# Altium schematic sheet SC942C_Coeur.SchDoc: Coeur
size 393 x 270 mm; CompanyName: Seccom; Address1: 521, rue du capt. François Garbit; Address2: 69440 Mornant; Address3: seccom@seccom.fr; Address4: www.seccom.fr; DocumentNumber: 2; SheetNumber: 2; SheetTotal: 8; PageSetup: Record=PageOptions|CenterHorizontal=True|CenterVertical=True|PrintScale=0.74|XCorrection=1.00|YCorrection=1.00|PrintKind=0|BorderSize=5000000|LeftOffset=0|BottomOffset=0|Orientation=2|PaperLength=1000|PaperWidth=1000|Scale=100|PaperSource=7|PrintQuality=-4|MediaType=1|DitherType=10|PaperKind=A4|PrintScaleMode=1
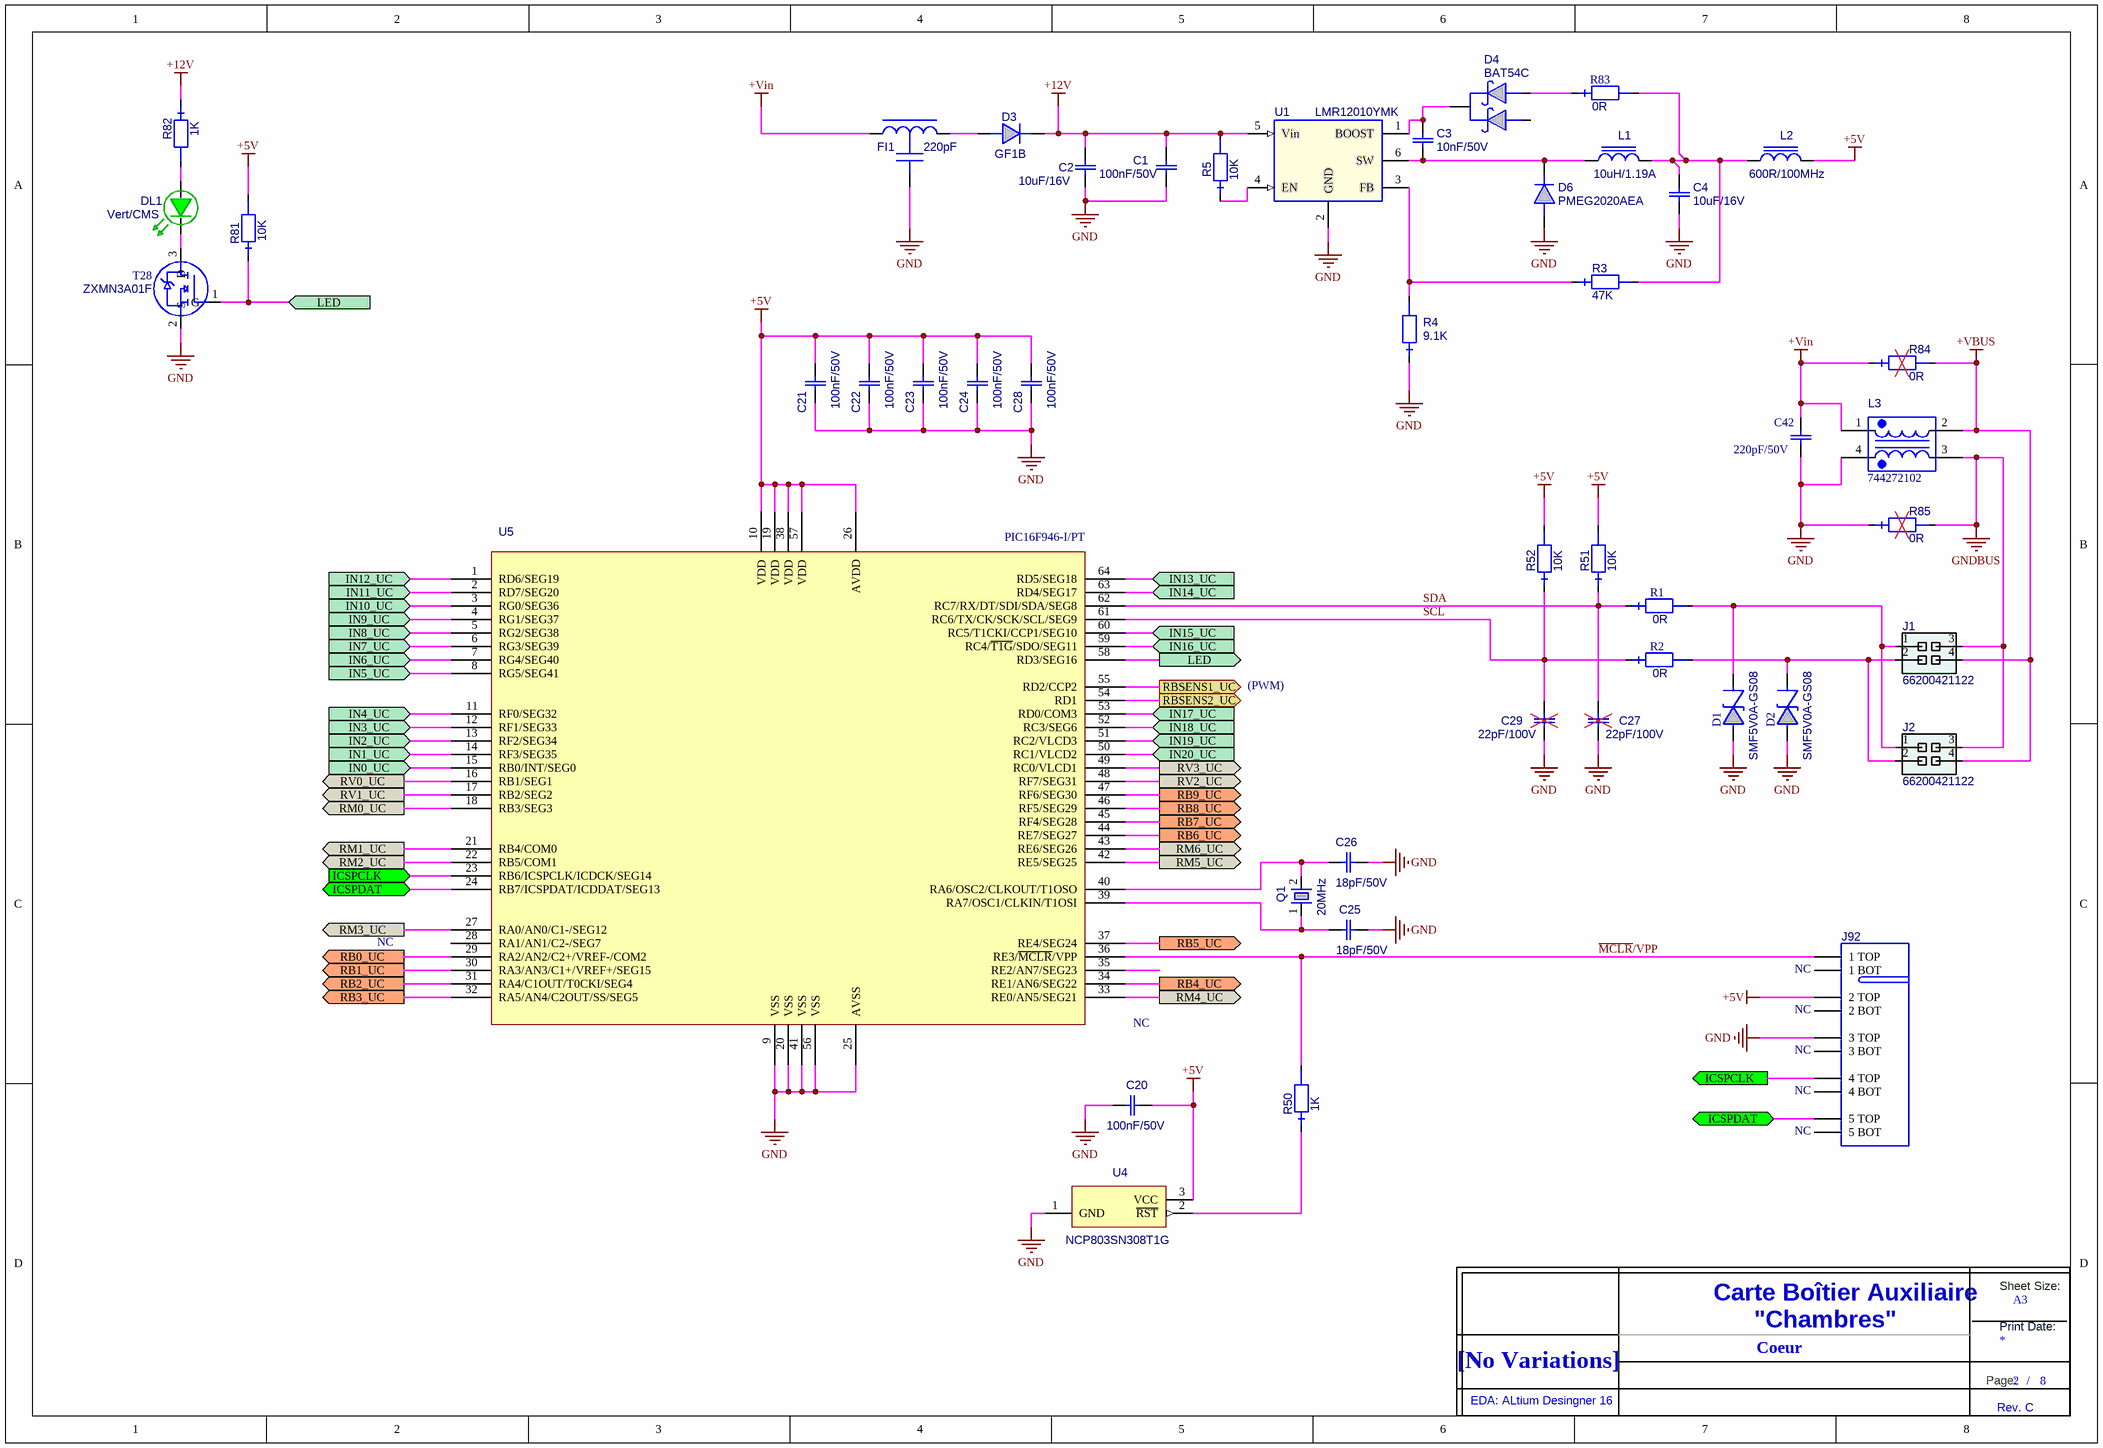
[diagram p0: SC942C_Coeur.SchDoc]

## Parts
C1  value 100nF/50V  [0805_ReflowSoldering_CAP]  (hidden comment: C_0805_X7R_10%_100N-50V)
C2  value 10uF/16V  [0805_ReflowSoldering_CAP]  (hidden comment: C_0805_X5R_10%_10U-16V)
C3  value 10nF/50V  [0603_ReflowSoldering_CAP]  (hidden comment: C_0603_X7R_10%_10N-50V)
C4  value 10uF/16V  [0805_ReflowSoldering_CAP]  (hidden comment: C_0805_X5R_10%_10U-16V)
C20  value 100nF/50V  [0805_ReflowSoldering_CAP]  (hidden comment: C_0805_X7R_10%_100N-50V)
C21  value 100nF/50V  [0805_ReflowSoldering_CAP]  (hidden comment: C_0805_X7R_10%_100N-50V)
C22  value 100nF/50V  [0805_ReflowSoldering_CAP]  (hidden comment: C_0805_X7R_10%_100N-50V)
C23  value 100nF/50V  [0805_ReflowSoldering_CAP]  (hidden comment: C_0805_X7R_10%_100N-50V)
C24  value 100nF/50V  [0805_ReflowSoldering_CAP]  (hidden comment: C_0805_X7R_10%_100N-50V)
C25  value 18pF/50V  [0603_ReflowSoldering_CAP]  (hidden comment: C_0603_NPO_5%_18P-50V)
C26  value 18pF/50V  [0603_ReflowSoldering_CAP]  (hidden comment: C_0603_NPO_5%_18P-50V)
C27  value 22pF/100V  [0805_ReflowSoldering_CAP]  (hidden comment: C_0805_NPO_5%_22P-100V)  (no BOM)
C28  value 100nF/50V  [0805_ReflowSoldering_CAP]  (hidden comment: C_0805_X7R_10%_100N-50V)
C29  value 22pF/100V  [0805_ReflowSoldering_CAP]  (hidden comment: C_0805_NPO_5%_22P-100V)  (no BOM)
C42  Capacitance: 220pF/50V  [0603_ReflowSoldering_CAP]  (hidden comment: C_0603_NPO_5%_220pF-50V)
D1  SMF5V0A-GS08  [DO219AB-SMF-P_ReflowSoldering]
D2  SMF5V0A-GS08  [DO219AB-SMF-P_ReflowSoldering]
D3  GF1B  [DO214BA-P]
D4  BAT54C  [SOT23_3L_ReflowSoldering]
D6  PMEG2020AEA  [SOD323_ReflowSoldering]
DL1  value Vert/CMS  [LED_0805_KPx_Green]  (hidden comment: LED_0805_VERT_KP2012)
FI1  value 220pF  [NFE31P]  (hidden comment: EMIFIL_220P_25V/6A_NFE31PT221D1E9L)
J1  value 66200421122  [MICRO-MATE-N-LOK_WURTH+TYCO_2X02_D]  (hidden comment: MICRO-MATE-N-LOK_WURTH_2X02_D)
J2  value 66200421122  [MICRO-MATE-N-LOK_WURTH+TYCO_2X02_D]  (hidden comment: MICRO-MATE-N-LOK_WURTH_2X02_D)
J92  EMB_ZEC_1893711_HOTE  [EMB_ZEC_1893711_HOTE_NOBOTT]  (value not drawn)  (no BOM)
L1  value 10uH/1.19A  [SELF_WE-TPC_4.8x4.78_(type4828)]  (hidden comment: SELF_10UH_1.19A_744043100)
L2  value 600R/100MHz  [1206_ReflowSoldering_FERRITE]  (hidden comment: IND_FERRITE_1206_74279218)
L3  744272102  [744272102]
Q1  value 20MHz  [QUARTZ_HC49_11.5X5_CMS]  (hidden comment: QUARTZ_HC49/4HSMX_20M)
R1  value 0R  [0805_ReflowSoldering_RES]  (hidden comment: RES_0805_1%_100PPM_0R)
R2  value 0R  [0805_ReflowSoldering_RES]  (hidden comment: RES_0805_1%_100PPM_0R)
R3  value 47K  [0805_ReflowSoldering_RES]  (hidden comment: RES_0805_1%_100PPM_47K)
R4  value 9.1K  [0805_ReflowSoldering_RES]  (hidden comment: RES_0805_1%_100PPM_9.1K)
R5  value 10K  [0805_ReflowSoldering_RES]  (hidden comment: RES_0805_1%_100PPM_10K)
R50  value 1K  [0805_ReflowSoldering_RES]  (hidden comment: RES_0805_1%_100PPM_1K)
R51  value 10K  [0805_ReflowSoldering_RES]  (hidden comment: RES_0805_1%_100PPM_10K)
R52  value 10K  [0805_ReflowSoldering_RES]  (hidden comment: RES_0805_1%_100PPM_10K)
R81  value 10K  [0805_ReflowSoldering_RES]  (hidden comment: RES_0805_1%_100PPM_10K)
R82  value 1K  [0805_ReflowSoldering_RES]  (hidden comment: RES_0805_1%_100PPM_1K)
R83  value 0R  [0805_ReflowSoldering_RES]  (hidden comment: RES_0805_1%_100PPM_0R)
R84  value 0R  [0603_ReflowSoldering_RES]  (hidden comment: RES_0603_1%_100PPM_0R)  (no BOM)
R85  value 0R  [0603_ReflowSoldering_RES]  (hidden comment: RES_0603_1%_100PPM_0R)  (no BOM)
T28  ZXMN3A01F  [SOT23_3L_ReflowSoldering]
Title_new?  DNI  (value not drawn)  (graphical)
U1  LMR12010YMK  [SOT23_6L]
U4  NCP803SN308T1G  [SOT23_3L_ReflowSoldering]
U5  PIC16F946-I/PT  [QFP_064_E0,50_10X10MM]

## Ports
ICSPCLK (in), ICSPCLK (out), ICSPDAT, ICSPDAT (bidir), IN0_UC (in), IN1_UC (in), IN2_UC (in), IN3_UC (in), IN4_UC (in), IN5_UC (in), IN6_UC (in), IN7_UC (in), IN8_UC (in), IN9_UC (in), IN10_UC (in), IN11_UC (in), IN12_UC (in), IN13_UC (in), IN14_UC (in), IN15_UC (in), IN16_UC (in), IN17_UC (in), IN18_UC (in), IN19_UC (in), IN20_UC (in), LED (in), LED (out), RB0_UC (out), RB1_UC (out), RB2_UC (out), RB3_UC (out), RB4_UC (out), RB5_UC (out), RB6_UC (out), RB7_UC (out), RB8_UC (out), RB9_UC (out), RBSENS1_UC (out), RBSENS2_UC (out), RM0_UC (out), RM1_UC (out), RM2_UC (out), RM3_UC (out), RM4_UC (out), RM5_UC (out), RM6_UC (out), RV0_UC (out), RV1_UC (out), RV2_UC (out), RV3_UC (out)

## Nets
+5V: C20.1 C21.2 C22.2 C23.2 C24.2 C28.2 J92.2(2_TOP) L2.2 R51.2 R52.2 R81.2 U4.3(VCC) U5.10(VDD) U5.19(VDD) U5.26(AVDD) U5.38(VDD) U5.57(VDD)
+12V: C1.1 C2.2 D3.K R5.2 R82.1 U1.5(Vin)
+VBUS: J1.4 J2.4 L3.2 R84.2
+Vin: C42.2 FI1.1 L3.1 R84.1
GND: C1.2 C2.1 C4.1 C20.2 C21.1 C22.1 C23.1 C24.1 C25.1 C26.1 C27.1 C28.1 C29.1 C42.1 D1.A D2.A D6.A FI1.2 J92.3(3_TOP) L3.4 R4.1 R85.1 T28.2(S) U1.2(GND) U4.1(GND) U5.9(VSS) U5.20(VSS) U5.25(AVSS) U5.41(VSS) U5.56(VSS)
GNDBUS: J1.3 J2.3 L3.3 R85.2
~{MCLR}/VPP: J92.1(1_TOP) R50.2 U5.36(RE3/~{MCLR}/VPP)
ICSPCLK: J92.4(4_TOP) U5.23(RB6/ICSPCLK/ICDCK/SEG14) ; port ICSPCLK
ICSPDAT: J92.5(5_TOP) U5.24(RB7/ICSPDAT/ICDDAT/SEG13) ; port ICSPDAT
IN0_UC: U5.15(RB0/INT/SEG0) ; port IN0_UC
IN1_UC: U5.14(RF3/SEG35) ; port IN1_UC
IN2_UC: U5.13(RF2/SEG34) ; port IN2_UC
IN3_UC: U5.12(RF1/SEG33) ; port IN3_UC
IN4_UC: U5.11(RF0/SEG32) ; port IN4_UC
IN5_UC: U5.8(RG5/SEG41) ; port IN5_UC
IN6_UC: U5.7(RG4/SEG40) ; port IN6_UC
IN7_UC: U5.6(RG3/SEG39) ; port IN7_UC
IN8_UC: U5.5(RG2/SEG38) ; port IN8_UC
IN9_UC: U5.4(RG1/SEG37) ; port IN9_UC
IN10_UC: U5.3(RG0/SEG36) ; port IN10_UC
IN11_UC: U5.2(RD7/SEG20) ; port IN11_UC
IN12_UC: U5.1(RD6/SEG19) ; port IN12_UC
IN13_UC: U5.64(RD5/SEG18) ; port IN13_UC
IN14_UC: U5.63(RD4/SEG17) ; port IN14_UC
IN15_UC: U5.60(RC5/T1CKI/CCP1/SEG10) ; port IN15_UC
IN16_UC: U5.59(RC4/~{T1G}/SDO/SEG11) ; port IN16_UC
IN17_UC: U5.53(RD0/COM3) ; port IN17_UC
IN18_UC: U5.52(RC3/SEG6) ; port IN18_UC
IN19_UC: U5.51(RC2/VLCD3) ; port IN19_UC
IN20_UC: U5.50(RC1/VLCD2) ; port IN20_UC
LED: R81.1 T28.1(G) U5.58(RD3/SEG16) ; port LED
RB0_UC: U5.29(RA2/AN2/C2+/VREF-/COM2) ; port RB0_UC
RB1_UC: U5.30(RA3/AN3/C1+/VREF+/SEG15) ; port RB1_UC
RB2_UC: U5.31(RA4/C1OUT/T0CKI/SEG4) ; port RB2_UC
RB3_UC: U5.32(RA5/AN4/C2OUT/SS/SEG5) ; port RB3_UC
RB4_UC: U5.34(RE1/AN6/SEG22) ; port RB4_UC
RB5_UC: U5.37(RE4/SEG24) ; port RB5_UC
RB6_UC: U5.44(RE7/SEG27) ; port RB6_UC
RB7_UC: U5.45(RF4/SEG28) ; port RB7_UC
RB8_UC: U5.46(RF5/SEG29) ; port RB8_UC
RB9_UC: U5.47(RF6/SEG30) ; port RB9_UC
RBSENS1_UC: U5.55(RD2/CCP2) ; port RBSENS1_UC
RBSENS2_UC: U5.54(RD1) ; port RBSENS2_UC
RM0_UC: U5.18(RB3/SEG3) ; port RM0_UC
RM1_UC: U5.21(RB4/COM0) ; port RM1_UC
RM2_UC: U5.22(RB5/COM1) ; port RM2_UC
RM3_UC: U5.27(RA0/AN0/C1-/SEG12) ; port RM3_UC
RM4_UC: U5.33(RE0/AN5/SEG21) ; port RM4_UC
RM5_UC: U5.42(RE5/SEG25) ; port RM5_UC
RM6_UC: U5.43(RE6/SEG26) ; port RM6_UC
RV0_UC: U5.16(RB1/SEG1) ; port RV0_UC
RV1_UC: U5.17(RB2/SEG2) ; port RV1_UC
RV2_UC: U5.48(RF7/SEG31) ; port RV2_UC
RV3_UC: U5.49(RC0/VLCD1) ; port RV3_UC
SCL: C29.2 R2.1 R52.1 U5.61(RC6/TX/CK/SCK/SCL/SEG9)
SDA: C27.2 R1.1 R51.1 U5.62(RC7/RX/DT/SDI/SDA/SEG8)
NetC3_1: C3.1 D6.K L1.1 U1.6(SW)
NetC3_2: C3.2 D4.3 U1.1(BOOST)
NetC4_2: C4.2 L1.2 L2.1 R3.2 R83.2
NetC25_2: C25.2 Q1.1 U5.39(RA7/OSC1/CLKIN/T1OSI)
NetC26_2: C26.2 Q1.2 U5.40(RA6/OSC2/CLKOUT/T1OSO)
NetD1_K: D1.K J1.1 J2.1 R1.2
NetD2_K: D2.K J1.2 J2.2 R2.2
NetD3_A: D3.A FI1.3
NetD4_1: D4.1 R83.1
NetDL1_A: DL1.A R82.2
NetDL1_K: DL1.K T28.3(D)
NetR3_1: R3.1 R4.2 U1.3(FB)
NetR5_1: R5.1 U1.4(EN)
NetR50_1: R50.1 U4.2(~{RST})

Not connected (* = marked no-connect by the designer): D4 2; J92 6(1_BOT) 7(2_BOT) 8(3_BOT) 9(4_BOT) 10(5_BOT); L1 3 4 5 6; U5 28(RA1/AN1/C2-/SEG7) 35(RE2/AN7/SEG23)

## Notes on the sheet
- (PWM)
- NC
- (near J92) NC
- Coeur
- (in symbol Title_new_1) Sheet Size:; Carte Boîtier Auxiliaire; A3; "Chambres"; Print Date:; [No Variations]; Page:; /; EDA: ALtium Desingner 16; Rev. C

## Library data of the parts
C1 C20-C24 C28 = C_0805_X7R_10%_100N-50V: Condensateur céramique, X7R, 10%, CMS 0805; Creation: LJ; Verification: LJ (28/05/04); Reference: 000042/00; Boitier: 0805; Remarque: {Remarque}; Fabricant: AVX; Ref Fab: 08055C104KAT2A; Coeff: 1; ComponentLink1URL: o:\_Documentation\Datasheets\BC_Components\Condo_CMS_NPO-X7R-Y5V.pdf; ComponentLink2URL: o:\_Documentation\Datasheets\_BOITIERS\PASSIF_CMS\RC_0805_(2x1,25)_(Schneider).PDF; Config: *; ComponentLink1Description: Datasheet; ComponentLink2Description: Datasheet Boitier; Supplier 1: Farnell; Supplier Part Number 1: 499687
C2 C4 = C_0805_X5R_10%_10U-16V: Condensateur céramique, X5R, 10%, CMS 0805; Creation: LJ (12/09/11); Reference: 001715/00; Boitier: 0805; Remarque: {Remarque}; Coeff: 1; Fabricant: Murata; Ref Fab: GRM219R61C106KA73D; Verification: *; ComponentLink1URL: o:\_Documentation\Datasheets\; ComponentLink2URL: o:\_Documentation\Datasheets\_Boitiers\PASSIF_CMS\RC_0805_(2x1,25)_(Schneider).pdf; Config: *; ComponentLink1Description: Datasheet; ComponentLink2Description: Datasheet Boitier
C3 = C_0603_X7R_10%_10N-50V: Condensateur céramique, X7R, 10%, CMS 0603; Creation: CHD; Boitier: 0603; Remarque: {Remarque}; Coeff: 1; Fabricant: Kemet; Ref Fab: C0603C103K5RAC; ComponentLink1URL: o:\_Documentation\Datasheets\Kemet\Condos_Ceramic_CMS.pdf; ComponentLink2URL: o:\_Documentation\Datasheets\_BOITIERS\PASSIF_CMS\; Config: *; ComponentLink1Description: Datasheet; ComponentLink2Description: Datasheet Boitier; Supplier 1: Farnell; Supplier Part Number 1: 1414609
C25 C26 = C_0603_NPO_5%_18P-50V: Condensateur céramique, NPO, 5%, CMS 0603, 18pF/50V; Creation: FB (04/07/12); Boitier: 0603; Remarque: {Remarque}; Fabricant: Kemet; Ref Fab: C0603C180J5GAC; Coeff: 1; ComponentLink2URL: o:\_Documentation\Datasheets\_BOITIERS\PASSIF_CMS\; Config: *; ComponentLink1Description: Datasheet; ComponentLink2Description: Datasheet Boitier; Supplier 1: Farnell; Supplier Part Number 1: 1414620
C27 C29 = C_0805_NPO_5%_22P-100V: Condensateur céramique, NPO, 5%, CMS 0805; Creation: LJ; Verification: LJ (28/05/04); Boitier: 0805; Remarque: {Remarque}; Fabricant: AVX; Ref Fab: 08051A220JAT2A; Coeff: 1; ComponentLink1URL: o:\_Documentation\Datasheets\BC_Components\Condo_CMS_NPO-X7R-Y5V.pdf; ComponentLink2URL: o:\_Documentation\Datasheets\_BOITIERS\PASSIF_CMS\RC_0805_(2x1,25)_(Schneider).PDF; Config: *; ComponentLink1Description: Datasheet; ComponentLink2Description: Datasheet Boitier; Supplier 1: Farnell; Supplier 2: Mouser; Supplier Part Number 1: 317500; Supplier Part Number 2: 581-08051A220J
C42 = C_0603_NPO_5%_220pF-50V: Multilayer Ceramic Capacitors MLCC - SMD/SMT 50volts 220pF C0G 5%; Manufacturer: Kemet; Manufacturer Part Number: C0603C221J5GACTU; Temperature Coefficient: C0G, NP0; Ref Fab: C0603C221J5GAC; Value: 220pF/50V; Supplier 1: Digi-Key; RoHS: RoHS Compliant; Category: Capacitors; Stock 1: 173034; Pricing 1: 1=0.1, 10=0.042, 50=0.0228, 100=0.0193, 250=0.01576, 500=0.01348, 1000=0.0105 (USD); Packaging: Cut Tape (CT); Part Status: Active; Tolerance: ±5%; Operating Temperature: -55°C ~ 125°C; Features: Low ESL; Ratings: -; Applications: General Purpose; Failure Rate: -; Mounting Type: Surface Mount, MLCC; Package / Case: 0603 (1608 Metric); Size / Dimension: 0.063" L x 0.031" W (1.60mm x 0.80mm); Height - Seated (Max): -; Thickness (Max): 0.034" (0.87mm); Lead Spacing: -; Lead Style: -; ComponentLink1URL: http://www.kemet.com/docfinder?Partnumber=C0603C221J5GACTU; ComponentLink1Description: http://www.kemet.com/docfinder?Partnumber=C0603C221J5GACTU; Supplier Part Number 1: 399-1066-1-ND; Fabricant: Kemet
D1 D2 = SMF5V0A-GS08: Diode Transil/TVS unidirectionnelle (A), 200W, 5V, CMS; Creation: LJ; Boitier: DO219AB/SMF; Remarque: {Remarque}; Fabricant: Vishay; Coeff: 1; Verification: *; Ref Fab: SMF5V0A-GS08; ComponentLink1URL: o:\_Documentation\Datasheets\Vishay\SMF5V0A~51A.pdf; ComponentLink2URL: o:\_Documentation\Datasheets\_BOITIERS\; Config: *; ComponentLink1Description: Datasheet; ComponentLink2Description: Datasheet Boitier; Value: SMF5V0A-GS08; Supplier 1: Farnell; Supplier 2: Mouser; Supplier Part Number 1: 1617696; Supplier Part Number 2: 78-SMF5V0A
D3 = GF1B: Diode de Redressement, Vrrm=100V, If=1A, Vf=1.1V, CMS; Creation: LJ; Reference: 000919/00; Boitier: DO214BA; Fabricant: Fairchild; Coeff: 1; Ref Fab: GF1B; ComponentLink1URL: o:\_Documentation\Datasheets\Fairchild\GF1A-M.PDF; ComponentLink2URL: o:\_Documentation\Datasheets\_BOITIERS\ACTIF_CMS\; Config: *; ComponentLink1Description: Datasheet; ComponentLink2Description: Datasheet Boitier; Value: GF1B; Supplier 1: Farnell; Supplier 2: Mouser; Supplier Part Number 1: 1467477; Supplier Part Number 2: 512-GF1B
D4 = BAT54C: Diode Schottky double, BAT54 cathode com, Vrrm=30V, If=300mA, Vf=0.4Vmax, CMS; Creation: LJ (14/05/02); Reference: 000597/00; Boitier: SOT23_3L; Remarque: {Remarque}; Fabricant: NXP; Coeff: 1; Verification: LJ (14/05/02); Ref Fab: BAT54C; ComponentLink1URL: o:\_Documentation\Datasheets\NXP\BAT54_series.pdf; ComponentLink2URL: o:\_Documentation\Datasheets\_BOITIERS\ACTIF_CMS\SOT\SOT_23_3P_(Schneider).PDF; Config: *; ComponentLink1Description: Datasheet; ComponentLink2Description: Datasheet Boitier; Value: BAT54C; Supplier 1: Farnell; Supplier Part Number 1: 1081192
D6 = PMEG2020AEA: Diode Schottky, Vrrm=20V, If=2A, Vf=450V, CMS; Creation: PDP 10/07/12; Verification: LJ (02/08/12); Boitier: SOD323; Remarque: {Remarque}; Coeff: 1; Fabricant: NXP; ComponentLink1URL: o:\_Documentation\Datasheets\NXP\PMEG2020AEA.PDF; ComponentLink2URL: o:\_Documentation\Datasheets\_BOITIERS\ACTIF_CMS\SOD\SOD_80_(MLL34)_(Schneider).PDF; Config: *; ComponentLink1Description: Datasheet; ComponentLink2Description: Datasheet Boitier; Ref Fab: PMEG2020AEA; Value: PMEG2020AEA; Supplier 1: Farnell; Supplier Part Number 1: 8737940; Supplier 2: Mouser; Supplier Part Number 2: 771-PMEG2020AEA-T/R
DL1 = LED_0805_VERT_KP2012: LED CMS 0805, Vert, Vf 2.5V@20mA (4-15mCd), 525nm, vue 120°; Creation: LJ (12/01/09); Reference: 000037/00; Boitier: 0805; Remarque: {Remarque}; Fabricant: Kingbright; Ref Fab: KP-2012SGC; Coeff: 1; Verification: *; ComponentLink1URL: o:\_Documentation\Datasheets\Kingbright\Leds_0805_Green_KP-2012SGC.pdf; ComponentLink2URL: o:\_Documentation\Datasheets\Kingbright\Leds_0805_Green_KP-2012SGC.pdf; Config: *; ComponentLink1Description: Datasheet; ComponentLink2Description: Datasheet Boitier; Supplier 1: Farnell; Supplier Part Number 1: 1318243
FI1 = EMIFIL_220P_25V/6A_NFE31PT221D1E9L: Filtre EMI selfique-capacitif, -20/+50%, 25Vcc/6A, -40/+85°C, 220pF; Creation: LJ; Boitier: 1206; Remarque: Anciennement série NFM60R...; Reference: 000785/00; Fabricant: Murata; Coeff: 1; Verification: *; Ref Fab: NFE31PT221D1E9L; ComponentLink1URL: o:\_Documentation\Datasheets\Murata\EMIFIL_NFE31P.pdf; ComponentLink2URL: o:\_Documentation\Datasheets\_BOITIERS\; Config: *; ComponentLink1Description: Datasheet; ComponentLink2Description: Datasheet Boitier
J1 J2 = MICRO-MATE-N-LOK_WURTH_2X02_D: Embase type Micro Mate-n-Lok, e3mm, 4pts, droit, cont. étamés 20mR, 250V/5A, Iso 1500V, -40/+105°C; Creation: LJ (01/08/12); Boitier: Micro Mate-n-Lok 4 D; Remarque: {Remarque}; Fabricant: Wurth Elektronik; Coeff: 1; Ref Fab: 66200421122; ComponentLink1URL: o:\_Documentation\Datasheets\; ComponentLink2URL: o:\_Documentation\Datasheets\; Config: *; ComponentLink1Description: Datasheet; ComponentLink2Description: Datasheet Boitier
J92 = EMB_ZEC_1893711_HOTE: Implantation CI pour connecteur ZEC 1,0/5-ST-3,5 C1 R1,5 (ref 1893711); Creation: JPL (18/07/12); Fabricant: Phoenix Contact; Coeff: 1; Config: *; ComponentLink1Description: Datasheet; ComponentLink2Description: Datasheet Boitier
L1 = SELF_10UH_1.19A_744043100: Inductance bobinée CMS, 10uH +/- 10%, I=1.19A, Rdc=0.095R, SRF=40MHz, -40/+85°C; Creation: LJ (02/08/12); Boitier: 4.8x4.8_h2.8mm; Coeff: 1; Fabricant: Wurth Elektronik; Verification: *; ComponentLink1URL: O:\_Documentation\Datasheets\Wurth_Elektronik\744043100.pdf; ComponentLink2URL: O:\_Documentation\Datasheets\Wurth_Elektronik\744043100.pdf; Remarque: *; Config: *; ComponentLink1Description: Datasheet; ComponentLink2Description: Datasheet Boitier; Ref Fab: 744043100
L2 = IND_FERRITE_1206_74279218: Inductance à ferrite multicouches CMS, imp=600R@100MHz, +/-25%, Rdc=100mR, I=2A; Creation: LJ (12/08/08); Reference: 000049/00; Boitier: 1206; Remarque: Alternative aux selfs de choc; Coeff: 1; Fabricant: Wurth Elektronik; Verification: *; ComponentLink1URL: o:\_Documentation\Datasheets\Wurth_Elektronik\74279218.pdf; ComponentLink2URL: o:\_Documentation\Datasheets\_Boitiers\PASSIF_CMS\RC_1206_(3,2x1,6)_(Schneider).pdf; Config: *; ComponentLink1Description: Datasheet; ComponentLink2Description: Datasheet Boitier; Ref Fab: 74279218
L3 = IND_FERRITE_WE-SL5_2X1000UH: Common Mode Filters / Chokes WE-SL5 Bifilar 2x1000uH 950mA; Manufacturer: Wurth Electronics Inc; Filter Type: Signal Line; Number of Lines: 2; Impedance @ Frequency: 3.6 kOhm @ 100kHz; Inductance @ Frequency: 1mH @ 100kHz; DC Resistance (DCR) (Max): 180 mOhm; Voltage Rating - DC: 80V; Fabricant: Wurth Elektronik; Supplier 1: Digi-Key; Manufacturer Part Number: 744272102; RoHS: RoHS Compliant; Category: Filters; Stock 1: 4893; Pricing 1: 1=3.57, 10=3.255, 50=2.94, 100=2.835 (USD); Packaging: Cut Tape (CT); Part Status: Active; Current Rating (Max): 950mA; Voltage Rating - AC: -; Operating Temperature: -40°C ~ 125°C; Ratings: -; Approvals: -; Features: -; Mounting Type: Surface Mount; Size / Dimension: 0.394" L x 0.343" W (10.00mm x 8.70mm); Height (Max): 0.256" (6.50mm); Package / Case: Horizontal, 4 PC Pad; ComponentLink1URL: http://katalog.we-online.de/pbs/datasheet/744272102.pdf; ComponentLink1Description: http://katalog.we-online.de/pbs/datasheet/744272102.pdf; Supplier Part Number 1: 732-1493-1-ND; Ref Fab: 744272102; Value: 744272102
Q1 = QUARTZ_HC49/4HSMX_20M: Quartz CMS série HCM49 (équiv HC49/US), -10/+60°C, +/-30ppm, 18pF; Creation: FB (04/09/12); Fabricant: Citizen; Ref Fab: HCM49 20.000MABJ-UT; Coeff: 1; Verification: *; Boitier: HC49/4HSMX; Remarque: *; ComponentLink1URL: O:\_Documentation\Datasheets\Citizen\Quartz_HC49-US_HCM49.pdf; ComponentLink2URL: o:\_Documentation\Datasheets\_BOITIERS\; Config: *; ComponentLink1Description: Datasheet; ComponentLink2Description: Datasheet Boitier; Supplier 1: Farnell; Supplier Part Number 1: 1611736; Supplier 2: Mouser; Supplier Part Number 2: 695-HCM49-20-U
R1 R2 R83 = RES_0805_1%_100PPM_0R: Résistance CMS 0805, 0.125W, 1%, 100ppm, 150V; Creation: LJ (06/02/09); Reference: 000052/00; Boitier: 0805; Remarque: {Remarque}; Fabricant: Welwyn; Ref Fab: WCR0805-R005JI; Coeff: 1; Verification: *; ComponentLink1URL: o:\_Documentation\Datasheets\Welwyn\Resistances_CMS_General.pdf; ComponentLink2URL: o:\_Documentation\Datasheets\_BOITIERS\PASSIF_CMS\RC_0805_(2x1,25)_(Schneider).PDF; Config: *; ComponentLink1Description: Datasheet; ComponentLink2Description: Datasheet Boitier; Supplier 1: Farnell; Supplier Part Number 1: 1099786
R3 = RES_0805_1%_100PPM_47K: Résistance CMS 0805, 0.125W, 1%, 100ppm, 150V; Creation: LJ (06/02/09); Reference: 000141/00; Boitier: 0805; Remarque: {Remarque}; Coeff: 1; Fabricant: Yageo; Ref Fab: C0805FR-0747KL; Verification: *; ComponentLink1URL: o:\_Documentation\Datasheets\BC_Components\Resistances_ThickFilmFlatChip_0402-0603-0805-1206.pdf; ComponentLink2URL: o:\_Documentation\Datasheets\_BOITIERS\PASSIF_CMS\RC_0805_(2x1,25)_(Schneider).PDF; Config: *; ComponentLink1Description: Datasheet; ComponentLink2Description: Datasheet Boitier
R4 = RES_0805_1%_100PPM_9.1K: Résistance CMS 0805, 0.125W, 1%, 100ppm, 150V; Creation: LJ (06/02/09); Reference: 000144/00; Boitier: 0805; Remarque: {Remarque}; Coeff: 1; Fabricant: Yageo; Ref Fab: RC0805FR-079K1L; Verification: *; ComponentLink1URL: o:\_Documentation\Datasheets\BC_Components\Resistances_ThickFilmFlatChip_0402-0603-0805-1206.pdf; ComponentLink2URL: o:\_Documentation\Datasheets\_BOITIERS\PASSIF_CMS\RC_0805_(2x1,25)_(Schneider).PDF; Config: *; ComponentLink1Description: Datasheet; ComponentLink2Description: Datasheet Boitier; Supplier 1: Mouser; Supplier Part Number 1: 603-RC0805FR-079K1L
R5 R51 R52 R81 = RES_0805_1%_100PPM_10K: Résistance CMS 0805, 0.125W, 1%, 100ppm, 150V; Creation: LJ (06/02/09); Reference: 000063/00; Boitier: 0805; Remarque: {Remarque}; Fabricant: Yageo; Ref Fab: RC0805FR-0710KL; Coeff: 1; Verification: *; ComponentLink1URL: o:\_Documentation\Datasheets\BC_Components\Resistances_ThickFilmFlatChip_0402-0603-0805-1206.pdf; ComponentLink2URL: o:\_Documentation\Datasheets\_BOITIERS\PASSIF_CMS\RC_0805_(2x1,25)_(Schneider).PDF; Config: *; ComponentLink1Description: Datasheet; ComponentLink2Description: Datasheet Boitier; Supplier 1: Farnell; Supplier Part Number 1: 9237755
R50 R82 = RES_0805_1%_100PPM_1K: Résistance CMS 0805, 0.125W, 1%, 100ppm, 150V; Creation: LJ (06/02/09); Reference: 000059/00; Boitier: 0805; Remarque: {Remarque}; Fabricant: Vishay; Ref Fab: CRCW08051K00FKEA; Coeff: 1; Verification: *; ComponentLink1URL: o:\_Documentation\Datasheets\BC_Components\Resistances_ThickFilmFlatChip_0402-0603-0805-1206.pdf; ComponentLink2URL: o:\_Documentation\Datasheets\_BOITIERS\PASSIF_CMS\RC_0805_(2x1,25)_(Schneider).PDF; Config: *; ComponentLink1Description: Datasheet; ComponentLink2Description: Datasheet Boitier; Supplier 1: Farnell; Supplier 2: Mouser; Supplier Part Number 1: 1469847; Supplier Part Number 2: 71-CRCW0805-1.0K-E3
R84 R85 = RES_0603_1%_100PPM_0R: Résistance, 0.100W, 1%, 100ppm, 75V, 0R; Creation: FB (04/07/12); Boitier: 0603; Remarque: {Remarque}; Fabricant: Vishay; Ref Fab: CRCW06030000Z0EA; Coeff: 1; Verification: *; ComponentLink1URL: O:\_Documentation\Datasheets\Vishay\Resistances_D-CRCWe3.pdf; ComponentLink2URL: o:\_Documentation\Datasheets\_BOITIERS\PASSIF_CMS\; Config: *; ComponentLink1Description: Datasheet; ComponentLink2Description: Datasheet Boitier; Supplier 1: Farnell; Supplier Part Number 1: 1469739
T28 = ZXMN3A01F: Transistor MOSN logique, Vdss=30V, Id=2A, Rdson=0.12R, CMS; Boitier: SOT23_3L; Remarque: {Remarque}; Creation: CHD; Fabricant: Zetex; Coeff: 1; Ref Fab: ZXMN3A01F; ComponentLink1URL: o:\_Documentation\Datasheets\; ComponentLink2URL: o:\_Documentation\Datasheets\_BOITIERS\ACTIF_CMS\SOT\SOT_23_3P_(Schneider).PDF; Config: *; ComponentLink1Description: Datasheet; Value: ZXMN3A01F; Supplier 1: Farnell; Supplier 2: Mouser; Supplier Part Number 1: 9525734; Supplier Part Number 2: 522-ZXMN3A01FTA
Title_new? = Title_new_1
U1 = LMR12010YMK: Régulateur ajustable step down, 0.8~20V, 1A, Vin=3~20V, -40/+125°C, CMS; Creation: PDP (10/07/12); Verification: LJ (02/08/12); Boitier: TSOT-6; Remarque: {Remarque}; Coeff: 1; Fabricant: National Semiconductor; ComponentLink1URL: O:\_Documentation\Datasheets\National_SemiConductors\LMR12010.pdf; ComponentLink2URL: o:\_Documentation\Datasheets\_Boitiers\ACTIF_CMS\; ComponentLink1Description: Datasheet; ComponentLink2Description: Datasheet Boitier; Ref Fab: LMR12010YMK; Value: LMR12010YMK; Supplier 1: Farnell; Supplier Part Number 1: 2060645; Supplier 2: Mouser; Supplier Part Number 2: 926-LMR12010YMKENOPB
U4 = NCP803SN308T1G: Superviseur de Reset pour microcontrolleur 3.08V -Pin SOT-23, CMS; Boitier: SOT23_3L; Remarque: {Remarque}; Creation: CHD; Fabricant: ON; Coeff: 1; Ref Fab: NCP803SN308T1G; ComponentLink1URL: o:\_Documentation\Datasheets\; ComponentLink2URL: o:\_Documentation\Datasheets\_BOITIERS\ACTIF_CMS\SOT\SOT_23_3P_(Schneider).PDF; Config: *; ComponentLink1Description: Datasheet; Value: NCP803SN308T1G
U5 = PIC16F946-I/PT: Microcontrôleur 8bit; Creation: CHD; Boitier: QFP64_e0.50_12x12mm; Remarque: {Remarque}; Fabricant: Microchip; Coeff: 1; Ref Fab: PIC16F946-I/PT; ComponentLink1URL: o:\_Documentation\Datasheets\MicroChip\PIC16F913_914_916_917_946.pdf; ComponentLink2URL: o:\_Documentation\Datasheets\_Boitiers\; Config: *; ComponentLink1Description: Datasheet; ComponentLink2Description: Datasheet Boitier; Value: PIC16F946-I/PT